# Altium project DLU_PPK57.PrjPCB (part 2 of 2)

## Sheet [4]-GPS_SIM_SSD.SchDoc
size A3; SheetNumber: 4
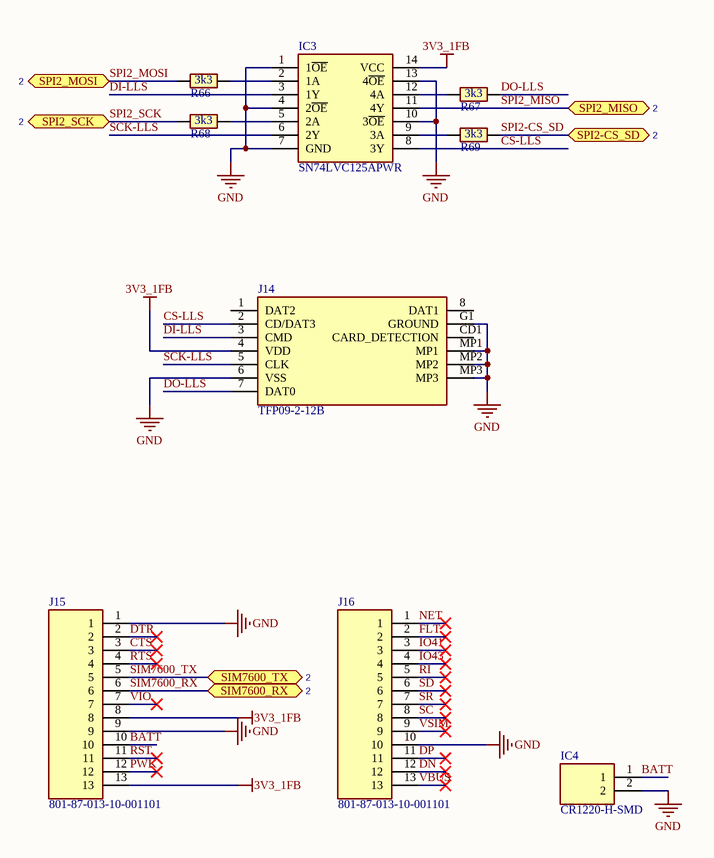
[diagram p4: [4]-GPS_SIM_SSD.SchDoc]

### Parts
IC3  SN74LVC125APWR  [SN74LVC125APWR]
IC4  CR1220-H-SMD  [CR1220HSMD]
J14  TFP09-2-12B  [TFP09212B]
J15  801-87-013-10-001101  [RHDR13W60P0X254_1X13_3302X254X700P]
J16  801-87-013-10-001101  [RHDR13W60P0X254_1X13_3302X254X700P]
R66  R0603_3k3  [RES-SMD-0603]  (value not drawn)
R67  R0603_3k3  [RES-SMD-0603]  (value not drawn)
R68  R0603_3k3  [RES-SMD-0603]  (value not drawn)
R69  R0603_3k3  [RES-SMD-0603]  (value not drawn)

### Ports
SIM7600_RX (bidir, see 2), SIM7600_TX (bidir, see 2), SPI2-CS_SD (bidir, see 2), SPI2_MISO (bidir, see 2), SPI2_MOSI (bidir, see 2), SPI2_SCK (bidir, see 2)

### Nets
3V3_1FB: IC3.14(VCC) J14.4(VDD) J15.8 J15.13
GND: IC3.1(1~{OE}) IC3.4(2~{OE}) IC3.7(GND) IC3.10(3~{OE}) IC3.13(4~{OE}) IC4.2 J14.6(VSS) J14.G1(GROUND) J14.MP1 J14.MP2 J14.MP3 J15.1 J15.9 J16.10
BATT: IC4.1 J15.10
CS-LLS: IC3.8(3Y) J14.2(CD/DAT3)
CTS: J15.3
DI-LLS: IC3.3(1Y) J14.3(CMD)
DN: J16.12
DO-LLS: J14.7(DAT0) R67.2
DP: J16.11
DTR: J15.2
FLT: J16.2
IO41: J16.3
IO43: J16.4
NET: J16.1
PWK: J15.12
RI: J16.5
RST: J15.11
RTS: J15.4
SC: J16.8
SCK-LLS: IC3.6(2Y) J14.5(CLK)
SD: J16.6
SIM7600_RX: J15.6 ; port SIM7600_RX
SIM7600_TX: J15.5 ; port SIM7600_TX
SPI2-CS_SD: R69.2 ; port SPI2-CS_SD
SPI2_MISO: IC3.11(4Y) ; port SPI2_MISO
SPI2_MOSI: R66.1 ; port SPI2_MOSI
SPI2_SCK: R68.1 ; port SPI2_SCK
SR: J16.7
VBUS: J16.13
VIO: J15.7
VSIM: J16.9
NetIC3_2: IC3.2(1A) R66.2
NetIC3_5: IC3.5(2A) R68.2
NetIC3_9: IC3.9(3A) R69.1
NetIC3_12: IC3.12(4A) R67.1

Not connected (* = marked no-connect by the designer): J14 1(DAT2) 8(DAT1) CD1(CARD_DETECTION)

### Notes on the sheet
- Sửa đổi
- 1
- Miêu tả
- CHỈNH SỬA
- Khu vực
- Thời gian
- 2
- 3
- 4
- Họ Tên
- Chữ ký
- Ngày ký
- TỔNG CÔNG TY CÔNG NGHIỆP CNC VIETTEL
- Mã dự án
- THIẾT KẾ:
- XUẤT BẢN VẼ:
- Bản vẽ thiết kế sơ đồ nguyên lý
- TRUNG TÂM CN CK & TĐH
- KHỐI 1
- KIỂM TRA:
- Mã thiết bị
- Mã bản vẽ
- PHÊ DUYỆT:
- Tên file:
- Mã phiên bản
- Kích thước
- A3
- Trang
- (in symbol R0603_3k3) 3k3

### Library data of the parts
IC3 = SN74LVC125APWR: Integrated Circuit; Manufacturer_Name: Texas Instruments; Datasheet Link: http://www.ti.com/lit/gpn/sn74lvc125a; Height: 1.2mm; Manufacturer_Part_Number: SN74LVC125APWR; Mouser Part Number: 595-SN74LVC125APWR; Mouser Price/Stock: https://www.mouser.co.uk/ProductDetail/Texas-Instruments/SN74LVC125APWR?qs=LfG3tU9ud8CIphjnOD7YXw%3D%3D; Arrow Part Number: SN74LVC125APWR; Arrow Price/Stock: https://www.arrow.com/en/products/sn74lvc125apwr/texas-instruments?region=nac
IC4 = CR1220-H-SMD: Integrated Circuit; Manufacturer_Name: ROBOTIS; Datasheet Link: https://www.robotics.org.za/CR1220-H-SMD; Height: 4.1mm; Manufacturer_Part_Number: CR1220-H-SMD
J14 = TFP09-2-12B: Connector; Manufacturer_Name: 100y; Datasheet Link: http://images.100y.com.tw/pdf_file/10-TFP09-2-12B.pdf; Height: 2mm; Manufacturer_Part_Number: TFP09-2-12B
J15 J16 = 801-87-013-10-001101: WR-PHD Socket Header, THT, Vertical, pitch 2.54mm, 1 Row, 13P; Manufacturer_Name: Preci-Dip; Datasheet Link: https://www.digikey.com/product-detail/en/preci-dip/801-87-013-10-001101/801-87-013-10-001101-ND/4126053; Height: 7mm; Manufacturer_Part_Number: 801-87-013-10-001101; Mouser Part Number: 437-8018701310001101; Mouser Price/Stock: https://www.mouser.co.uk/ProductDetail/Preci-dip/801-87-013-10-001101?qs=FtMuP6KVi2QzdVbXobm87A%3D%3D
R66-R69 = R0603_3k3: Resistor; Manufacturer_Name: Panasonic; Manufacturer_Part_Number: ERJ-3EKF3301V; Datasheet Link: http://industrial.panasonic.com/cdbs/www-data/pdf/RDA0000/AOA0000C86.pdf; Height: 0.55mm; Mouser Part Number: 667-ERJ-3EKF3301V; Mouser Price/Stock: https://www.mouser.co.uk/ProductDetail/Panasonic/ERJ-3EKF3301V?qs=MVjVSMjNRMr0RS%2FvmZkflA%3D%3D; Arrow Part Number: ERJ-3EKF3301V; Arrow Price/Stock: https://www.arrow.com/en/products/erj3ekf3301v/panasonic?region=nac

## Nets that join several sheets
3V3: [1]-Power (C9.1 C13.1 U2.5), [2]-MCU (29 pins)
3V3_1FB: [1]-Power (C8.1 C11.1 FB3.2 J2.2), [4]-GPS_SIM_SSD (IC3.14 J14.4 J15.8 J15.13)
5V0: [1]-Power (D2.2 D3.2 FB1.1 FB2.1), [3]-Digital Input (D11.1 FB5.1)
GND: [1]-Power (18 pins), [2]-MCU (46 pins), [3]-Digital Input (41 pins), [4]-GPS_SIM_SSD (14 pins)
VUSB: [1]-Power (D3.1), [3]-Digital Input (J13.1)
CAN_RX: [2]-MCU (IC1.81), [3]-Digital Input (IC2.1)
CAN_TX: [2]-MCU (IC1.82), [3]-Digital Input (IC2.2)
RS485_DIR1: [2]-MCU (IC1.60), [3]-Digital Input (R40.2 U6.2 U6.3)
RS485_DIR2: [2]-MCU (IC1.66), [3]-Digital Input (R49.2 U8.2 U8.3)
RS485_DIR3: [2]-MCU (IC1.57), [3]-Digital Input (R58.2 U10.2 U10.3)
RS485_DIR4: [2]-MCU (IC1.65), [3]-Digital Input (R41.2 U7.2 U7.3)
RS485_DIR5: [2]-MCU (IC1.67), [3]-Digital Input (R51.2 U9.2 U9.3)
RS485_DIR6: [2]-MCU (IC1.85), [3]-Digital Input (R59.2 U11.2 U11.3)
RS485_RX1: [2]-MCU (IC1.59), [3]-Digital Input (U6.1)
RS485_RX2: [2]-MCU (IC1.62), [3]-Digital Input (U8.1)
RS485_RX3: [2]-MCU (IC1.56), [3]-Digital Input (U10.1)
RS485_RX4: [2]-MCU (IC1.64), [3]-Digital Input (U7.1)
RS485_RX5: [2]-MCU (IC1.69), [3]-Digital Input (U9.1)
RS485_RX6: [2]-MCU (IC1.87), [3]-Digital Input (U11.1)
RS485_TX1: [2]-MCU (IC1.58), [3]-Digital Input (U6.4)
RS485_TX2: [2]-MCU (IC1.61), [3]-Digital Input (U8.4)
RS485_TX3: [2]-MCU (IC1.55), [3]-Digital Input (U10.4)
RS485_TX4: [2]-MCU (IC1.63), [3]-Digital Input (U7.4)
RS485_TX5: [2]-MCU (IC1.68), [3]-Digital Input (U9.4)
RS485_TX6: [2]-MCU (IC1.86), [3]-Digital Input (U11.4)
SIM7600_RX: [2]-MCU (IC1.83), [4]-GPS_SIM_SSD (J15.6)
SIM7600_TX: [2]-MCU (IC1.80), [4]-GPS_SIM_SSD (J15.5)
SPI2-CS_SD: [2]-MCU (IC1.96), [4]-GPS_SIM_SSD (R69.2)
SPI2_MISO: [2]-MCU (IC1.53), [4]-GPS_SIM_SSD (IC3.11)
SPI2_MOSI: [2]-MCU (IC1.54), [4]-GPS_SIM_SSD (R66.1)
SPI2_SCK: [2]-MCU (IC1.47), [4]-GPS_SIM_SSD (R68.1)
USB_DM: [2]-MCU (IC1.70), [3]-Digital Input (J13.2 R64.1)
USB_DP: [2]-MCU (IC1.71), [3]-Digital Input (J13.3 R65.1)